# Altium schematic sheet ANA_FRONT_END.SchDoc: Analog front end
size Letter; Organization: University of California; Address1: 475 Portola Plaza; Address2: Los Angeles, CA 90095; Revision: R01; SheetNumber: 1; SheetTotal: 1
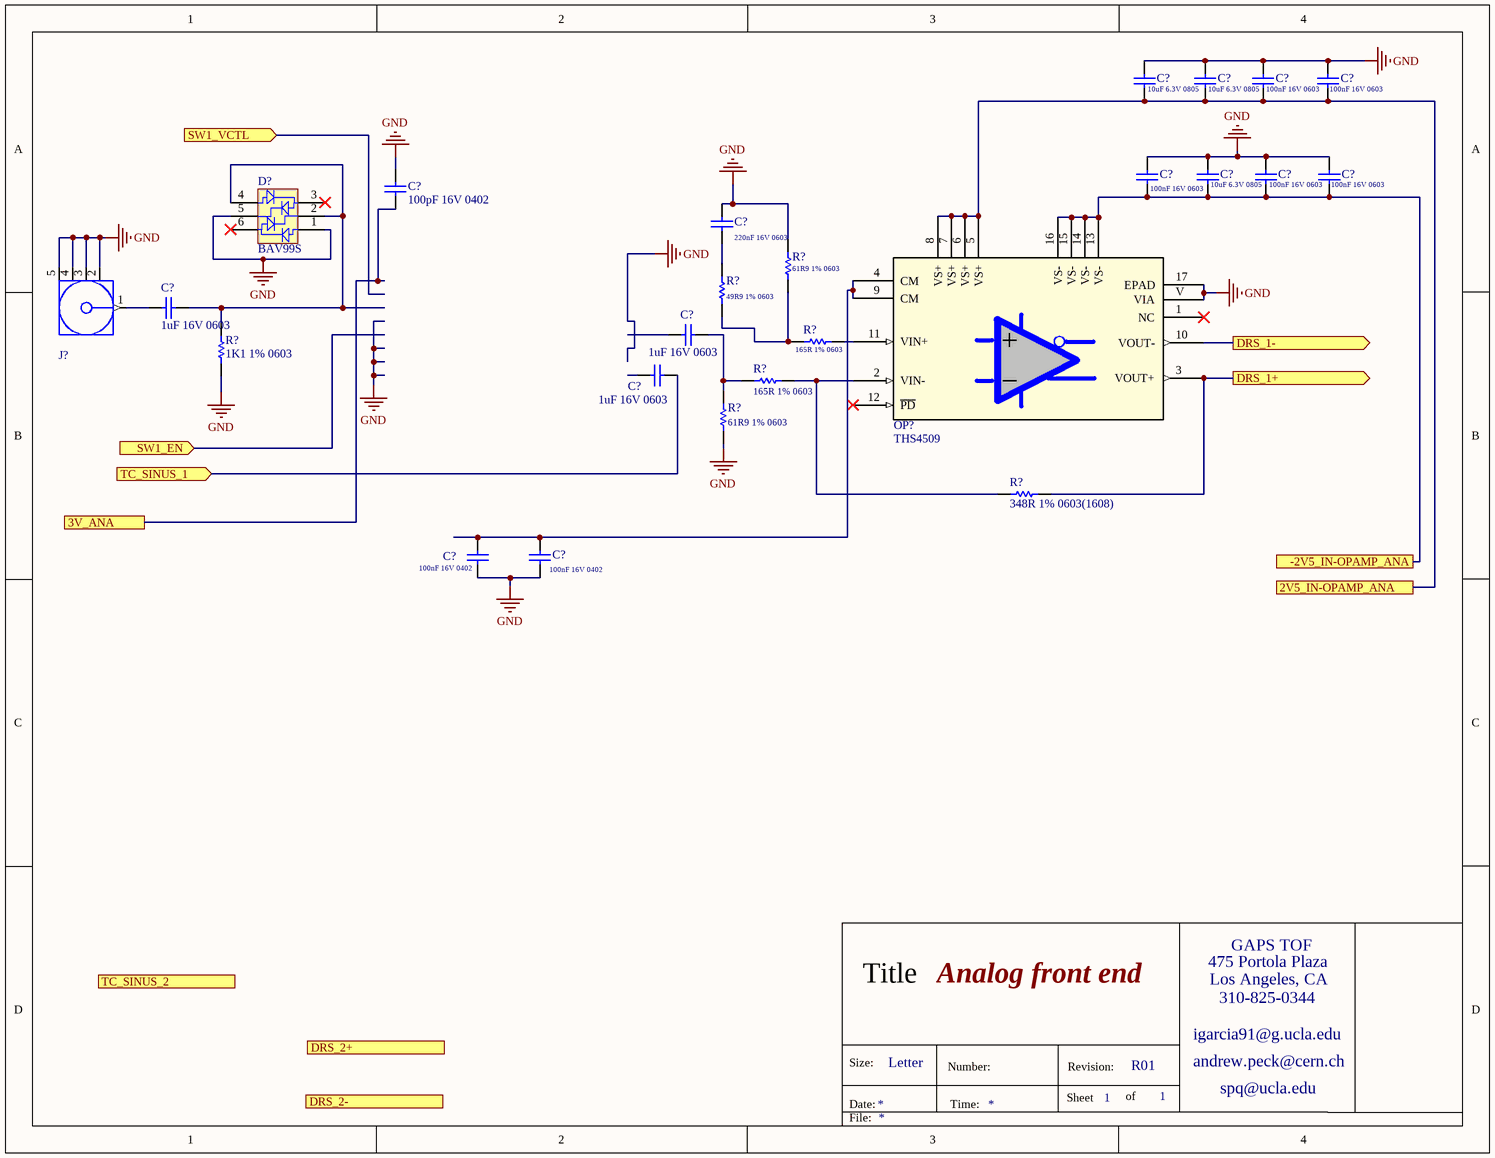
[diagram p0: ANA_FRONT_END.SchDoc]

## Parts
(Parts that share a designator on the sheet are numbered #1, #2 ... from top to bottom, then left to right.)
C?#1  10uF 6.3V 0805  [CAPC0805(2012)145_L]
C?#2  10uF 6.3V 0805  [CAPC0805(2012)145_L]
C?#3  100nF 16V 0603  [CAPC0603(1608)100_N]
C?#4  100nF 16V 0603  [CAPC0603(1608)100_N]
C?#5  100nF 16V 0603  [CAPC0603(1608)100_N]
C?#6  10uF 6.3V 0805  [CAPC0805(2012)145_L]
C?#7  100nF 16V 0603  [CAPC0603(1608)100_N]
C?#8  100nF 16V 0603  [CAPC0603(1608)100_N]
C?#9  100pF 16V 0402  [CAPC0402(1005)60_M]
C?#10  220nF 16V 0603  [CAPC0603(1608)100_M]
C?#11  1uF 16V 0603  [CAPC0603(1608)100_N]
C?#12  1uF 16V 0603  [CAPC0603(1608)100_N]
C?#13  1uF 16V 0603  [CAPC0603(1608)100_N]
C?#14  100nF 16V 0402  [CAPC0402(1005)60_M]
C?#15  100nF 16V 0402  [CAPC0402(1005)60_M]
D?  BAV99S  [INF-SOT363_V]
J?  CONREVSMA003.062  [CON-SMA-EDGE062]  (value not drawn)
OP?  THS4509  [RGT16]
R?#1  61R9 1% 0603  [RESC0603(1608)_M]
R?#2  49R9 1% 0603  [RESC0603(1608)_N]
R?#3  165R 1% 0603  [RESC0603(1608)_M]
R?#4  1K1 1% 0603  [RESC0603(1608)_N]
R?#5  165R 1% 0603  [RESC0603(1608)_M]
R?#6  61R9 1% 0603  [RESC0603(1608)_M]
R?#7  348R 1% 0603(1608)  [RESC0603(1608)_N]

## Ports
2V5_IN-OPAMP_ANA, 3V_ANA, -2V5_IN-OPAMP_ANA, DRS_1+ (out), DRS_1- (out), DRS_2+ (out), DRS_2- (out), SW1_EN (in), SW1_VCTL (in), TC_SINUS_1 (in), TC_SINUS_2 (in)

## Nets
GND: C?#1.2 C?#2.2 C?#3.2 C?#4.2 C?#5.2 C?#6.2 C?#7.2 C?#8.2 C?#9.2 C?#10.2 C?#14.1 C?#15.1 D?.1(A1) D?.5(K5) J?.2(GND) J?.3(GND) J?.4(GND) J?.5(GND) OP?.17(EPAD) OP?.V(VIA) R?#1.2 R?#4.1 R?#6.1
2V5_IN-OPAMP_ANA: C?#1.1 C?#2.1 C?#3.1 C?#4.1 OP?.5(VS+) OP?.6(VS+) OP?.7(VS+) OP?.8(VS+) ; port 2V5_IN-OPAMP_ANA
3V_ANA: C?#9.1 ; port 3V_ANA
-2V5_IN-OPAMP_ANA: C?#5.1 C?#6.1 C?#7.1 C?#8.1 OP?.13(VS-) OP?.14(VS-) OP?.15(VS-) OP?.16(VS-) ; port -2V5_IN-OPAMP_ANA
DRS_1+: OP?.3(VOUT+) R?#7.2 ; port DRS_1+
DRS_1-: OP?.10(VOUT-) ; port DRS_1-
TC_SINUS_1: C?#13.2 ; port TC_SINUS_1
NetC?#10_1: C?#10.1 R?#2.2
NetC?#11_1: C?#11.1 J?.1(Signal)
NetC?#11_2: C?#11.2 D?.2(K2) D?.4(A4) R?#4.2
NetC?#12_2: C?#12.2 R?#5.1 R?#6.2
NetC?#14_2: C?#14.2 C?#15.2 OP?.4(CM) OP?.9(CM)
NetOP?_2: OP?.2(VIN-) R?#5.2 R?#7.1
NetOP?_11: OP?.11(VIN+) R?#3.2
NetR?#1_1: R?#1.1 R?#2.1 R?#3.1

Not connected (* = marked no-connect by the designer): C?#12 1; C?#13 1; D? 3(C3)* 6(C6)*; OP? 1(NC)* 12(~{PD})*

## Notes on the sheet
- 475 Portola Plaza
- GAPS TOF
- Title
- igarcia91@g.ucla.edu
- Los Angeles, CA
- 310-825-0344
- Size:
- Date:
- Letter
- Number:
- Time:
- Sheet
- Revision:
- of
- andrew.peck@cern.ch
- spq@ucla.edu
- File:

## Library data of the parts
C?#1 C?#2 C?#6 = CMP-1036-04915-1: CAP 10uF 6.3V ±10% 0805 (2012 Metric) Thickness 1.45mm SMD; Tolerance: Â±10%; Case-EIA: 0805; Case-Metric: 2012; Technology: SMT; Rated Voltage: 6.3 V; Value: 10uF; Max Thickness: 1.45 mm
C?#3-C?#5 C?#7 C?#8 = CMP-1035-02585-1: CAP 100nF 16V ±20% 0603 (1608 Metric) Thickness 1mm SMD; Case-EIA: 0603; Tolerance: Â±20%; Case-Metric: 1608; Technology: SMT; Rated Voltage: 16 V; Value: 100nF; Max Thickness: 1 mm
C?#9 = CMP-1034-01236-1: CAP 100pF 16V ±5% 0402 (1005 Metric) Thickness 0.6mm SMD; Case-Metric: 1005; Case-EIA: 0402; Tolerance: Â±5%; Rated Voltage: 16 V; Technology: SMT; Value: 100pF; Max Thickness: 0.6 mm
C?#10 = CMP-1035-02644-1: CAP 220nF 16V ±10% 0603 (1608 Metric) Thickness 1mm SMD; Tolerance: Â±10%; Case-EIA: 0603; Case-Metric: 1608; Rated Voltage: 16 V; Max Thickness: 1 mm; Technology: SMT; Value: 220nF
C?#11-C?#13 = CMP-1035-02736-1: CAP 1uF 16V ±5% 0603 (1608 Metric) Thickness 1mm SMD; Case-Metric: 1608; Case-EIA: 0603; Tolerance: Â±5%; Technology: SMT; Max Thickness: 1 mm; Rated Voltage: 16 V; Value: 1uF
C?#14 C?#15 = CMP-1034-02070-1: CAP 100nF 16V ±20% 0402 (1005 Metric) Thickness 0.6mm SMD; Tolerance: Â±20%; Case-EIA: 0402; Case-Metric: 1005; Value: 100nF; Max Thickness: 0.6 mm; Technology: SMT; Rated Voltage: 16 V
D? = CMP-1176-00030-1: Silicon Switching Diode, SOT363, Reel, Green; Manufacturer: Infineon; VR (max): 80Â V; VBR (min): 85Â V; IF (max): 200Â mA; trr (max): 4Â ns; Green: TRUE; VF (max): 1.25Â V; Configuration: Quadruple; IR (max): 150Â nA; PackageReference: SOT363; Halogen-free: TRUE; ComponentLink3URL: http://www.infineon.com/dgdl/SOT363-Package_Overview.pdf?folderId=db3a30431936bc4b01195360bd8f3cdc&fileId=db3a30431936bc4b0119536b62bf3cf5; PartNumber: BAV99S; ComponentLink3Description: Package Specification; ComponentLink2URL: http://www.infineon.com/dgdl/bav99series.pdf?folderId=db3a30431400ef6801141b5844e103ea&fileId=db3a30431400ef6801141c1b237d042f; ComponentLink1Description: Manufacturer URL; ComponentLink2Description: Datasheet; ComponentLink1URL: http://www.infineon.com/; PackageDescription: 6-Pin Small Outline Transistor Package, 1.25 x 2 mm Body; Mounting Technology: Surface Mount
J? = CMP-0168-00046-1: PCB_Layout: Pads complies with manufacturer's recommendation.; DatasheetVersion: rev1.0, Jun-2006; PackageVersion: rev1.0, Jun-2006; PackageReference: CON-SMA-EDGE062
OP? = THS4509RGTT: Imported; Vendor: Texas Instruments; Built_By: EMA_UL_Team; C: Copyright (C) 2015 Accelerated Designs. All rights reserved; Manufacturer_Part_Number: THS4509RGTT; RefDes: RefDes; Type: DEV; Value: Value
R?#1 R?#6 = CMP-1012-00374-1: 61R9 0.1W 1% 0603 (1608 Metric)  SMD; Case-Metric: 1608; Case-EIA: 0603; Value: 61.90 Ohm; Technology: SMT; Tolerance: 1 %; Power: 0.1 W
R?#2 = CMP-1012-00363-1: 49R9 0.1W 1% 0603 (1608 Metric)  SMD; Case-Metric: 1608; Case-EIA: 0603; Value: 49.90 Ohm; Power: 0.1 W; Tolerance: 1 %; Technology: SMT
R?#3 R?#5 = CMP-1012-00420-1: 165R 0.1W 1% 0603 (1608 Metric)  SMD; Value: 165.00 Ohm; Case-EIA: 0603; Case-Metric: 1608; Tolerance: 1 %; Power: 0.1 W; Technology: SMT
R?#4 = CMP-1012-00514-1: 1K1 0.1W 1% 0603 (1608 Metric)  SMD; Case-Metric: 1608; Case-EIA: 0603; Value: 1100.00 Ohm; Technology: SMT; Tolerance: 1 %; Power: 0.1 W
R?#7 = CMP-1012-00457-1: 348R 0.1W 1% 0603 (1608 Metric)  SMD; Case-EIA: 0603; Case-Metric: 1608; Value: 348.00 Ohm; Technology: SMT; Power: 0.1 W; Tolerance: 1 %